# Altium schematic sheet RS485_USB.SchDoc
size A3; Address1: Address1; Address2: Address2; Address3: Address3; Address4: Address4
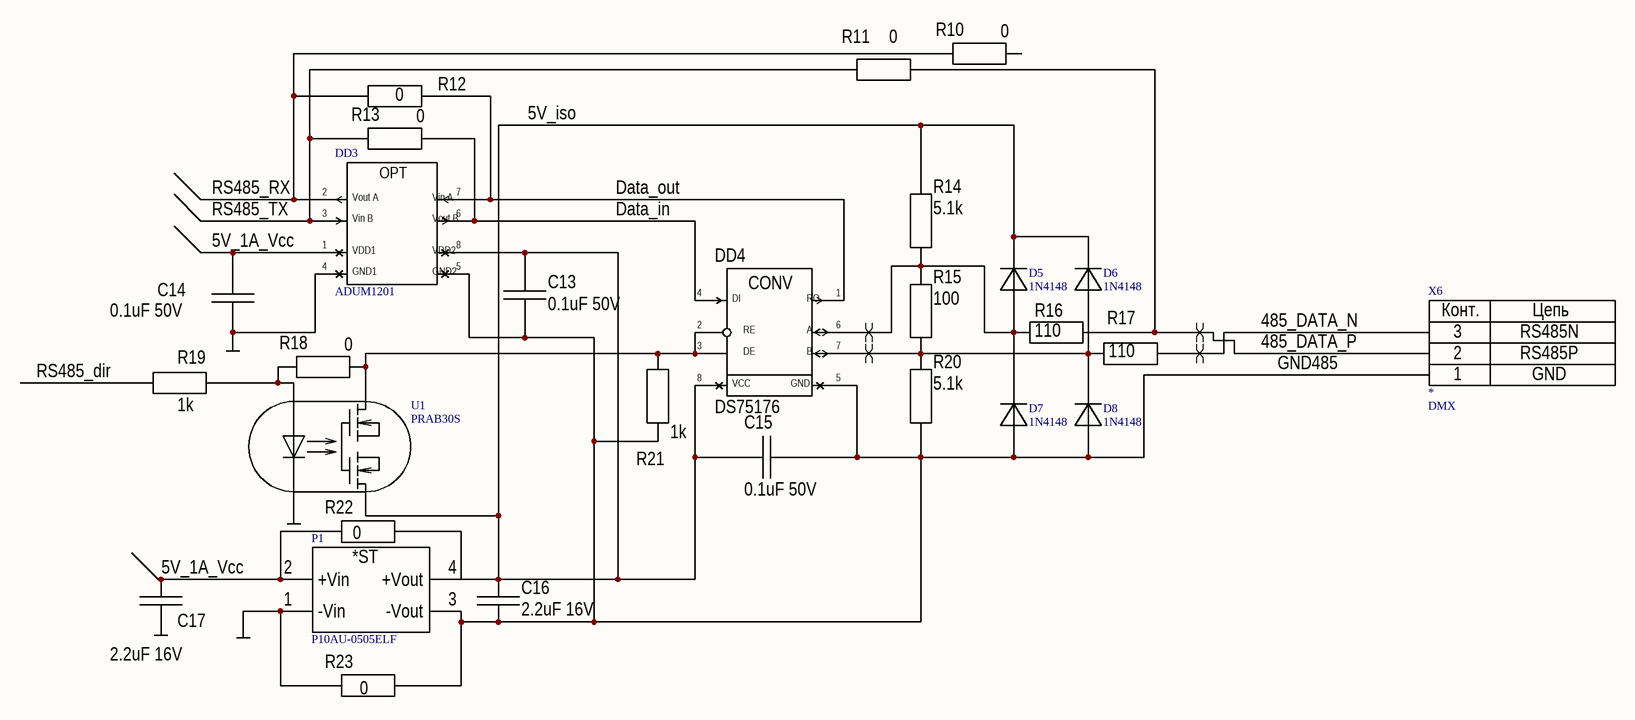
[diagram p0: RS485_USB.SchDoc]

## Parts
C13  0.1uF 50V  [0805_CAP]
C14  0.1uF 50V  [0805_CAP]
C15  0.1uF 50V  [0805_CAP]
C16  2.2uF 16V  [0805_CAP]
C17  2.2uF 16V  [0805_CAP]
D5  1N4148  [sod80c]
D6  1N4148  [sod80c]
D7  1N4148  [sod80c]
D8  1N4148  [sod80c]
DD3  ADUM1201  [soic-8]
DD4  DS75176  [soic-8]
P1  P10AU-0505ELF  [SIP4]
R10  0  [0805_RES]
R11  0  [0805_RES]
R12  0  [0805_RES]
R13  0  [0805_RES]
R14  5.1k  [0805_RES]
R15  100  [0805_RES]
R16  110  [0805_RES]
R17  110  [0805_RES]
R18  0  [0805_RES]
R19  1k  [0805_RES]
R20  5.1k  [0805_RES]
R21  1k  [0805_RES]
R22  0  [0805_RES]
R23  0  [0805_RES]
U1  PRAB30S  [sop4_optocoup]
X6  *  Destiny: DMX  [3pad_5.08]

## Nets
GND: C14.2 C17.1 DD3.4 P1.1(-Vin) R23.1 U1.2(C)
5V_1A_Vcc: C14.1 C17.2 DD3.1(A1) P1.2(+Vin) R22.1
5V_iso: C13.1 C15.1 C16.2 D5.2 D6.2 DD3.8 DD4.8 P1.4(+Vout) R14.1 R22.2 U1.3(E)
485_DATA_N: R17.2 X6.3
485_DATA_P: R11.2 R16.2 X6.2
Data_in: DD3.6 DD4.4 R13.2
Data_out: DD3.7 DD4.1 R12.2
GND485: C13.2 C15.2 C16.1 D7.1 D8.1 DD3.5 DD4.5 P1.3(-Vout) R20.2 R21.2 R23.2 X6.1
RS485_dir: R19.1
RS485_RX: DD3.2 R10.1 R12.1
RS485_TX: DD3.3 R11.1 R13.1
NetD5_1: D5.1 D7.2 DD4.6 R14.2 R15.1 R16.1
NetD6_1: D6.1 D8.2 DD4.7 R15.2 R17.1 R20.1
NetDD4_2: DD4.2 DD4.3 R18.2 R21.1 U1.4(C)
NetR18_1: R18.1 R19.2 U1.1(A)

Not connected (* = marked no-connect by the designer): R10 2

## Layout directives
differential pair: 485_DATA_N, 485_DATA_P, NetD5_1, NetD6_1

## Notes on the sheet
- Title
- Size:
- Date:
- A3
- Number:
- Time:
- Revision:
- Sheet
- of
- File:
- (in symbol 3pin_conn) Конт.; Цепь
- (in symbol ADUM1201) OPT; Vout A; Vin A; Vin B; Vout B; VDD1; VDD2; GND1; GND2
- (in symbol ds75176) CONV; DI; RO; RE; A; DE; B; VCC; GND
- (in symbol P10AU) *ST

## Library data of the parts
C13-C17 = Cap_np
  C13-C15: Value: 0.1uF 50V
  C16 C17: Value: 2.2uF 16V
D5-D8 = Diode: Value: 1N4148
P1 = P10AU: Value: P10AU-0505ELF
R10-R23 = Res
  R10-R13 R18 R22 R23: Value: 0
  R14 R20: Value: 5.1k
  R15: Value: 100
  R16 R17: Value: 110
  R19 R21: Value: 1k
U1 = Opto_Realy: Value: PRAB30S
X6 = 3pin_conn: PinName1: GND; PinName2: RS485P; PinName3: RS485N; Value: *
DD3 = ADUM1201: Value: ADUM1201
DD4 = ds75176: Value: DS75176